# Altium schematic sheet LPCB281 - RM57 LAUNCH.SchDoc
size A3; Address1: Factory 10; Address2: 9-13 Dingley Avenue, Dandeong, VICTORIA 3175, AUSTRALIA; DocumentNumber: 5; Revision: 1; SheetNumber: 5; SheetTotal: 5; Lockie__PCB_SUB_ASSEMBLY: PCB Sub Component; Lockie__PCB_ASSEMBLY: PCB Assembly; Lockie__LDL: LPCB281; Lockie__PCB_DESCRIPTION: Aux Prop Unit (APU)
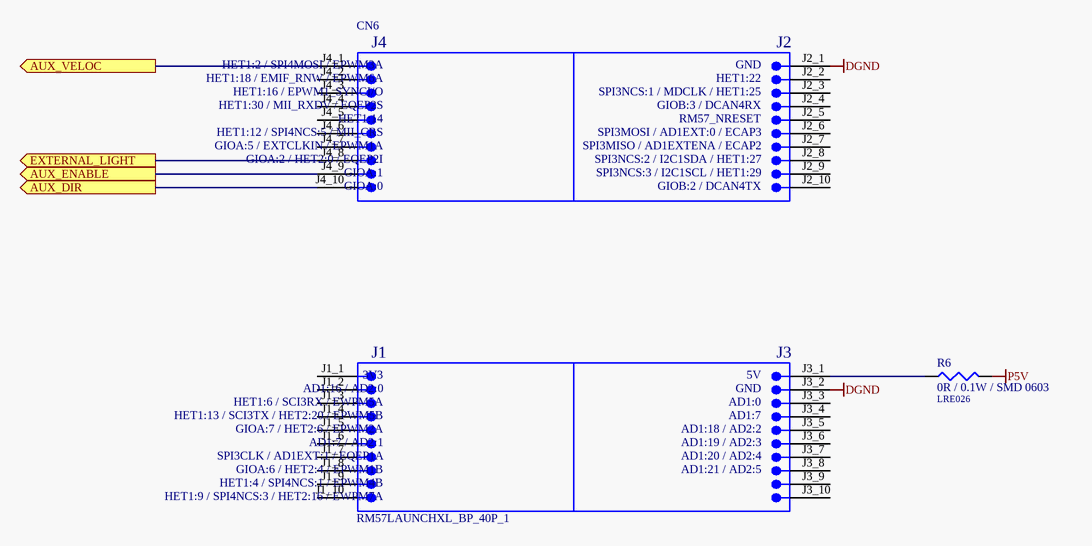
[diagram p0: LPCB281 - RM57 LAUNCH.SchDoc]

## Parts
CN6  RM57LAUNCHXL_BP_40P_1  [RM57LAUNCHXL_BP_40P_1]  (no BOM)
R6  0R / 0.1W / SMD 0603  LDL_NUMBER: LRE026  [LFP020__CR1608-0603-IPC7351_B]

## Ports
AUX_DIR (out), AUX_ENABLE (out), AUX_VELOC (out), EXTERNAL_LIGHT (out)

## Nets
DGND: CN6.J2_1 CN6.J3_2
P5V: R6.2
AUX_DIR: CN6.J4_10 ; port AUX_DIR
AUX_ENABLE: CN6.J4_9 ; port AUX_ENABLE
AUX_VELOC: CN6.J4_1 ; port AUX_VELOC
EXTERNAL_LIGHT: CN6.J4_8 ; port EXTERNAL_LIGHT
NetCN6_J3_1: CN6.J3_1 R6.1

Not connected (* = marked no-connect by the designer): CN6 J1_1 J1_2 J1_3 J1_4 J1_5 J1_6 J1_7 J1_8 J1_9 J1_10 J2_2 J2_3 J2_4 J2_5 J2_6 J2_7 J2_8 J2_9 J2_10 J3_3 J3_4 J3_5 J3_6 J3_7 J3_8 J3_9 J3_10 J4_2 J4_3 J4_4 J4_5 J4_6 J4_7

## Notes on the sheet
- PCB COMPONENT DESCRIPTION
- LDL NUMBER
- Assembly Details
- Size
- Drawing File Name
- Revision
- http://sil3.com.au
  ACN: 123 529 064
  Factory 10
  9-13 Dingley Avenue
  Dandenong, VICTORIA
  Australia
- Scale
- A3
- Sheet Details
- N.T.S
- Sheet:
- Of:
- (in symbol RM57LAUNCHXL_BP_40P_1) J4; J2; HET1:2 / SPI4MOSI / EPWM3A; GND; HET1:18 / EMIF_RNW / EPWM6A; HET1:22; HET1:16 / EPWM1_SYNCI/O; SPI3NCS:1 / MDCLK / HET1:25; HET1:30 / MII_RXDV / EQEP2S; GIOB:3 / DCAN4RX; HET1:14; RM57_NRESET; HET1:12 / SPI4NCS:5 / MII_CRS; SPI3MOSI / AD1EXT:0 / ECAP3; GIOA:5 / EXTCLKIN / EPWM1A; SPI3MISO / AD1EXTENA / ECAP2; GIOA:2 / HET2:0 / EQEP2I; SPI3NCS:2 / I2C1SDA / HET1:27; GIOA:1; SPI3NCS:3 / I2C1SCL / HET1:29; GIOA:0; GIOB:2 / DCAN4TX; J1; J3; 3V3; 5V; AD1:16 / AD2:0; HET1:6 / SCI3RX / EWPM5A; AD1:0; HET1:13 / SCI3TX / HET2:20 / EPWM5B; AD1:7; GIOA:7 / HET2:6 / EPWM2A; AD1:18 / AD2:2; AD1:7 / AD2:1; AD1:19 / AD2:3; SPI3CLK / AD1EXT:1 / EQEP1A; AD1:20 / AD2:4; GIOA:6 / HET2:4 / EPWM1B; AD1:21 / AD2:5; HET1:4 / SPI4NCS:1 / EPWM4B; HET1:9 / SPI4NCS:3 / HET2:16 / EWPM7A

## Library data of the parts
CN6 = RM57LAUNCHXL_BP_40P_1: Connector, RM57L843 LaunchXL, 40Pin Boosterpack Site1; FMEDA__CHANNEL: COM; FMEDA__OPERATING__CURRENT_MAX: 0; FMEDA__OPERATING__TEMP_MAX: 50; FMEDA__OPERATING__TEMP_MIN: -20; FMEDA__OPERATING__TEMP_TYP: 27; FMEDA__OPERATING__VOLTAGE_MAX: 16; FMEDA__OPERATING__VOLTAGE_TYP: 12; FMEDA__FUNCTION_IN_SYSTEM: *; FMEDA__OPERATING__CURRENT_MIN: 0; FMEDA__OPERATING__CURRENT_TYP: 0; FMEDA__OPERATING__VOLTAGE_MIN: 0
R6 = 0R / 0.1W / SMD 0603: Resistor, Ceramic Chip, 0R, 0.1W, SMD 0603 [LRE026]; Value: 0; FMEDA__OPERATING__TEMP_MAX: 50; FMEDA__OPERATING__TEMP_MIN: -20; FMEDA__OPERATING__TEMP_TYP: 27; FMEDA__CHANNEL: COM; FMEDA__OPERATING__POWER_MAX: 0; FMEDA__OPERATING__POWER_MIN: 0; FMEDA__OPERATING__VOLTAGE_MAX: 0; FMEDA__OPERATING__VOLTAGE_MIN: 0; FMEDA__OPERATING__VOLTAGE_TYP: 0; FMEDA__FUNCTION_IN_SYSTEM: *